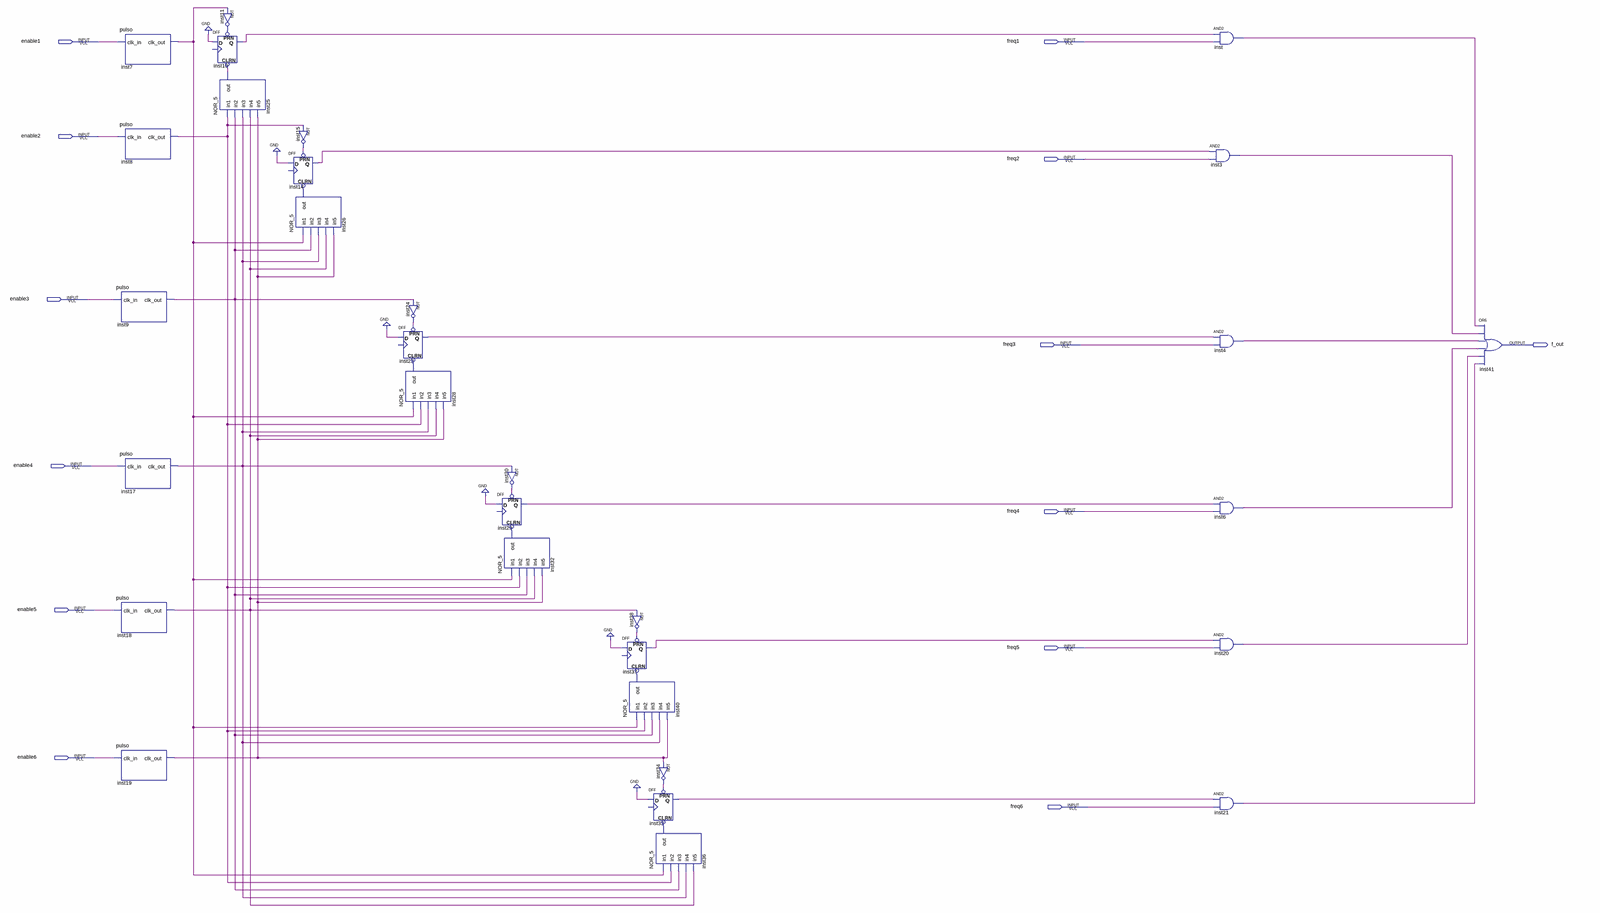
[diagram p0: schematic sheet, whole]
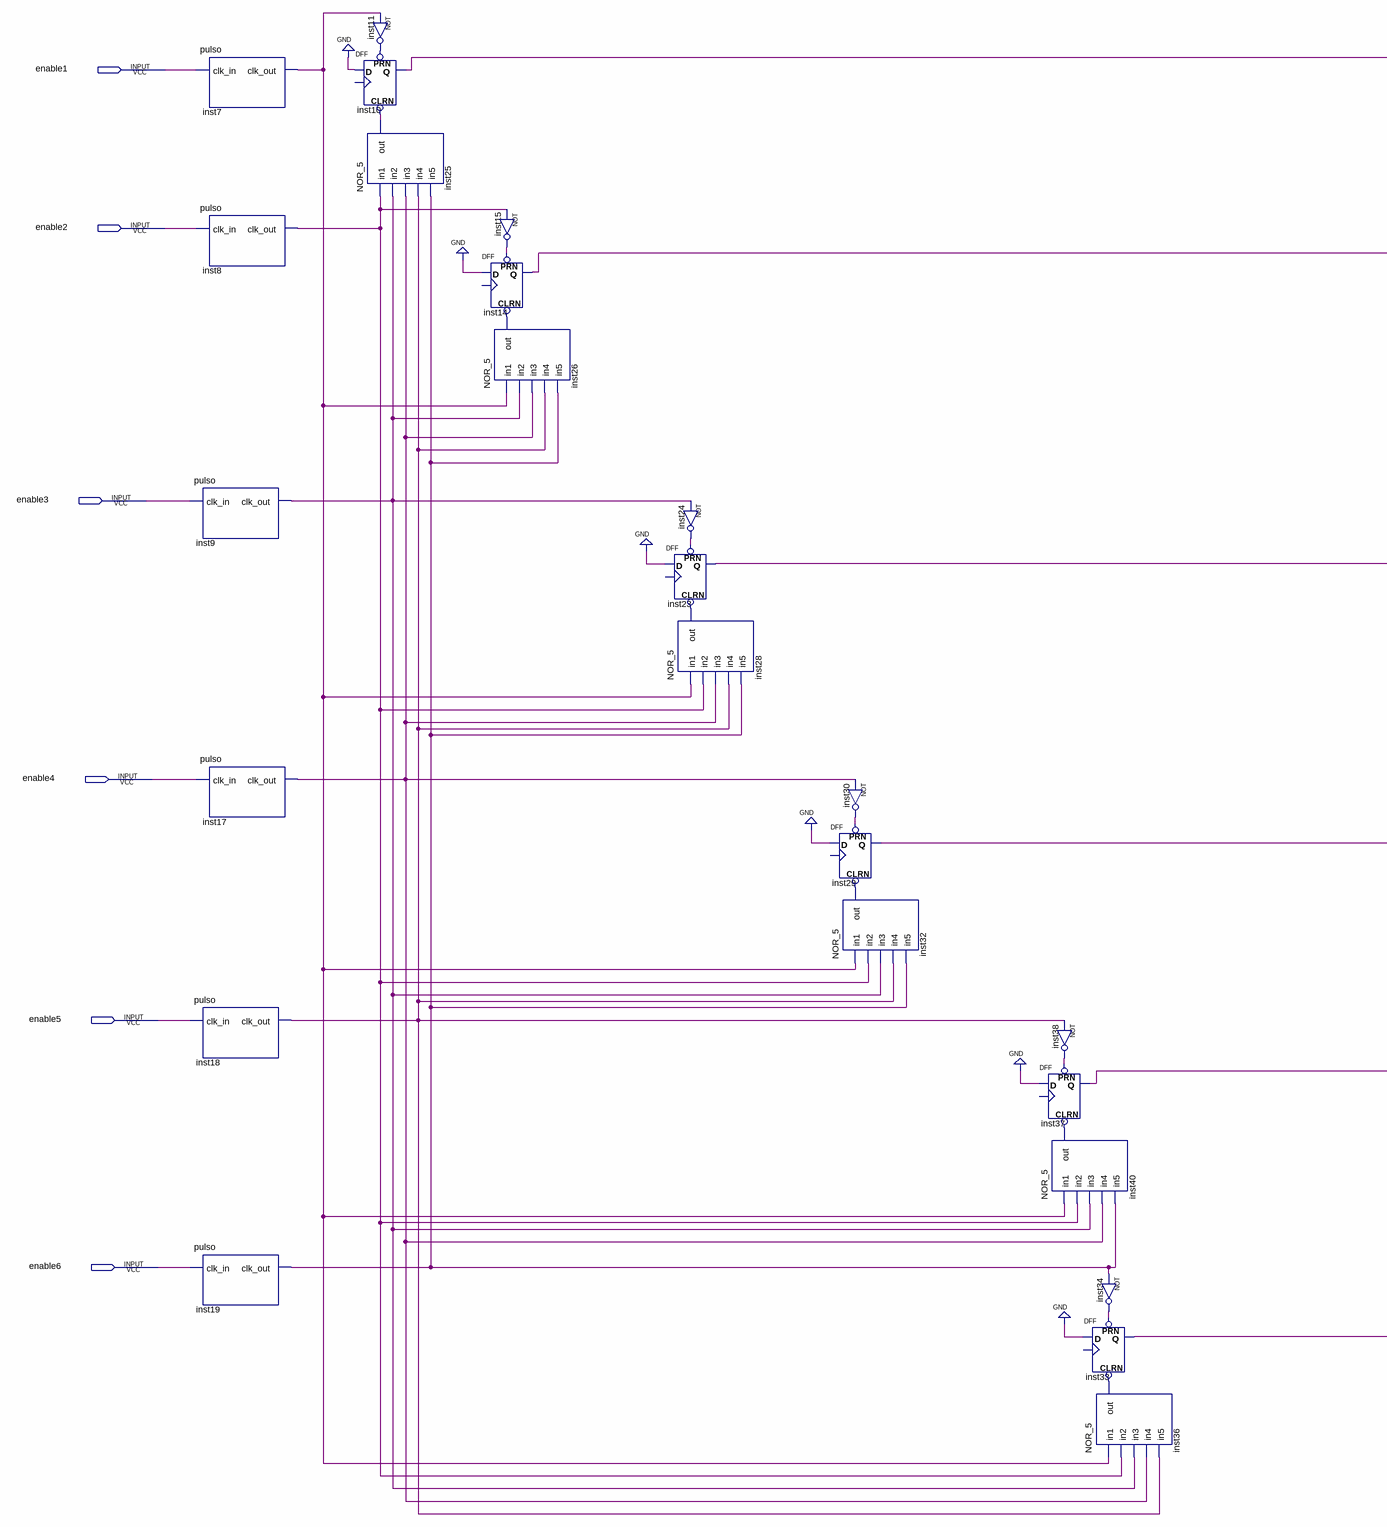
[diagram p1: schematic sheet, left part]
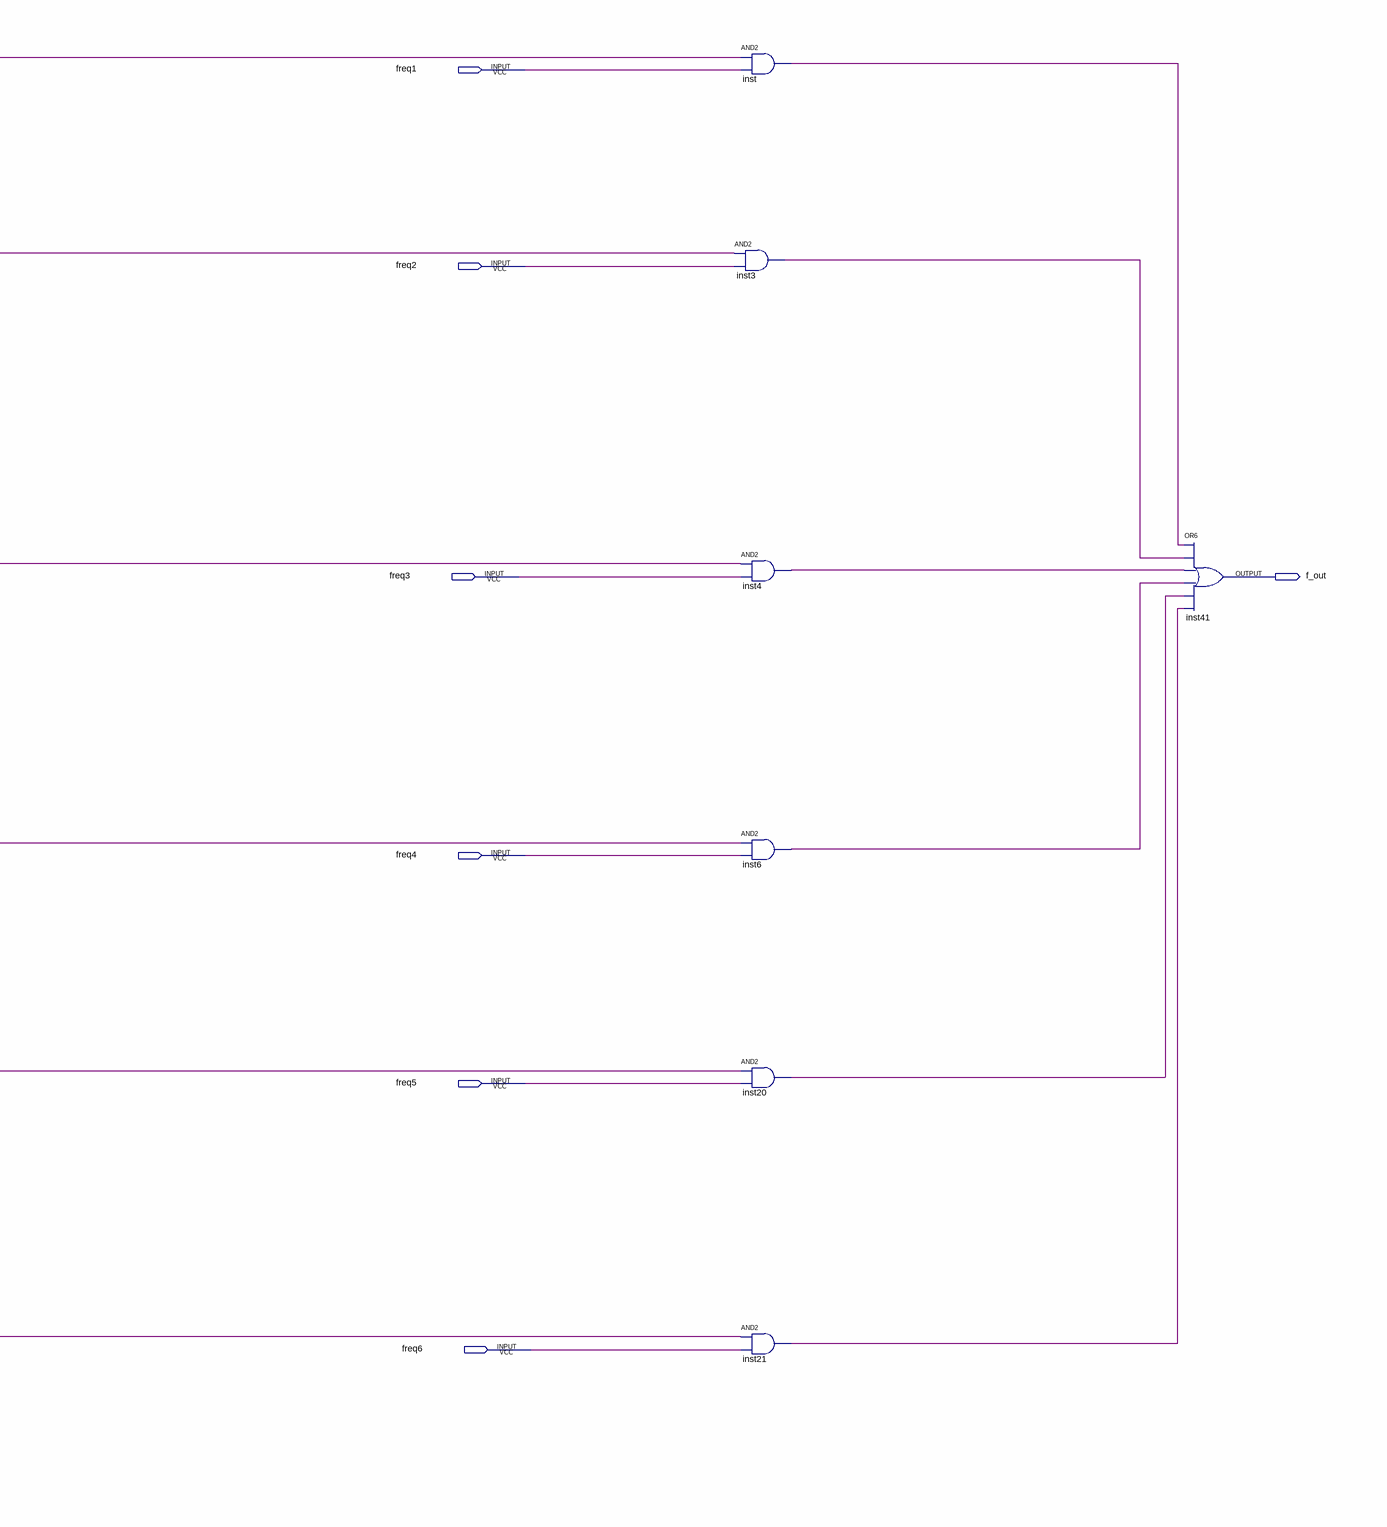
[diagram p2: schematic sheet, right part]
// Quartus schematic prioridade.bdf as structural Verilog: 31 symbols, 13 pins
module prioridade (
  input  enable1,
  input  freq1,
  input  enable2,
  input  freq2,
  input  enable3,
  input  freq3,
  input  enable4,
  input  freq4,
  input  enable5,
  input  freq5,
  input  enable6,
  input  freq6,
  output f_out
);

  wire inst3_out, inst4_out, inst6_out, inst7_clk_out, inst8_clk_out, inst9_clk_out, inst10_q, inst11_out,
       inst14_q, inst15_out, inst17_clk_out, inst18_clk_out, inst19_clk_out, inst20_out, inst21_out,
       inst23_q, inst24_out, inst25_out, inst26_out, inst28_out, inst29_q, inst30_out, inst32_out, inst33_q,
       inst34_out, inst36_out, inst37_q, inst38_out, inst40_out, inst_out;

  pulso inst7 (.clk_in(enable1), .clk_out(inst7_clk_out));
  pulso inst8 (.clk_in(enable2), .clk_out(inst8_clk_out));
  pulso inst9 (.clk_in(enable3), .clk_out(inst9_clk_out));
  pulso inst17 (.clk_in(enable4), .clk_out(inst17_clk_out));
  pulso inst18 (.clk_in(enable5), .clk_out(inst18_clk_out));
  pulso inst19 (.clk_in(enable6), .clk_out(inst19_clk_out));
  DFF inst10 (.CLRN(inst25_out), .D(1'b0), .PRN(inst11_out), .Q(inst10_q));  // open: CLK
  NOR_5 inst25 (
    .in1(inst8_clk_out), .in2(inst9_clk_out), .in3(inst17_clk_out), .in4(inst18_clk_out),
    .in5(inst19_clk_out), .out(inst25_out));
  not inst11 (inst11_out, inst7_clk_out);
  not inst15 (inst15_out, inst8_clk_out);
  DFF inst14 (.CLRN(inst26_out), .D(1'b0), .PRN(inst15_out), .Q(inst14_q));  // open: CLK
  NOR_5 inst26 (
    .in1(inst7_clk_out), .in2(inst9_clk_out), .in3(inst17_clk_out), .in4(inst18_clk_out),
    .in5(inst19_clk_out), .out(inst26_out));
  not inst24 (inst24_out, inst9_clk_out);
  DFF inst23 (.CLRN(inst28_out), .D(1'b0), .PRN(inst24_out), .Q(inst23_q));  // open: CLK
  NOR_5 inst28 (
    .in1(inst7_clk_out), .in2(inst8_clk_out), .in3(inst17_clk_out), .in4(inst18_clk_out),
    .in5(inst19_clk_out), .out(inst28_out));
  not inst30 (inst30_out, inst17_clk_out);
  DFF inst29 (.CLRN(inst32_out), .D(1'b0), .PRN(inst30_out), .Q(inst29_q));  // open: CLK
  NOR_5 inst32 (
    .in1(inst7_clk_out), .in2(inst8_clk_out), .in3(inst9_clk_out), .in4(inst18_clk_out),
    .in5(inst19_clk_out), .out(inst32_out));
  not inst38 (inst38_out, inst18_clk_out);
  DFF inst37 (.CLRN(inst40_out), .D(1'b0), .PRN(inst38_out), .Q(inst37_q));  // open: CLK
  NOR_5 inst40 (
    .in1(inst7_clk_out), .in2(inst8_clk_out), .in3(inst9_clk_out), .in4(inst17_clk_out),
    .in5(inst19_clk_out), .out(inst40_out));
  not inst34 (inst34_out, inst19_clk_out);
  DFF inst33 (.CLRN(inst36_out), .D(1'b0), .PRN(inst34_out), .Q(inst33_q));  // open: CLK
  NOR_5 inst36 (
    .in1(inst7_clk_out), .in2(inst8_clk_out), .in3(inst9_clk_out), .in4(inst17_clk_out),
    .in5(inst18_clk_out), .out(inst36_out));
  and inst (inst_out, inst10_q, freq1);
  and inst3 (inst3_out, inst14_q, freq2);
  and inst4 (inst4_out, inst23_q, freq3);
  and inst6 (inst6_out, inst29_q, freq4);
  and inst20 (inst20_out, inst37_q, freq5);
  and inst21 (inst21_out, inst33_q, freq6);
  or inst41 (f_out, inst_out, inst3_out, inst4_out, inst6_out, inst20_out, inst21_out);
endmodule
